# EAGLE schematic LiPo_Battery_Charger_MCP73831 (EAGLE 7.7.0)
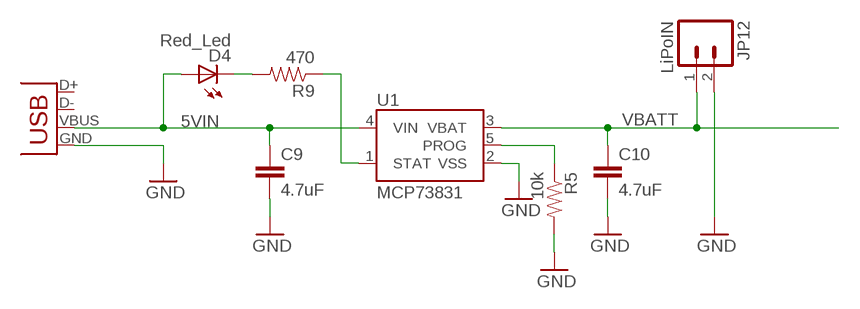
[diagram p0: schematic, sheet 1]

## Parts
C9  4.7uF  CAP0402-CAP  [0402-CAP]
C10  4.7uF  CAP0402-CAP  [0402-CAP]
D4  Red_Led  LED0603  [LED-0603]
JP12  LiPoIN  M02PTH  [1X02]
R5  10k  RESISTOR0402-RES  [0402-RES]
R9  470  RESISTOR0402-RES  [0402-RES]
U1  MCP73831  [SOT23-5]
X1  USB-MICROB  [USB-MICROB]

## Nets
5VIN: C9.1 D4.A U1.4(VIN) X1.VBUS
GND: C9.2 C10.2 JP12.2 R5.2 U1.2(VSS) X1.GND
N$8: D4.C R9.2
N$11: R5.1 U1.5(PROG)
N$14: R9.1 U1.1(STAT)
VBATT: C10.1 JP12.1 U1.3(VBAT)
Unconnected: X1.D+ X1.D-

## Library data of the parts
C9 C10 = SparkFun:CAP: Capacitor Standard 0603 ceramic capacitor, and 0.1" leaded capacitor.
D4 = SparkFun:LED: LEDs Standard schematic elements and footprints for 5mm, 3mm, 1206, and 0603 sized LEDs. 5mm - Spark Fun Electronics SKU : COM-00529 (and others)
JP12 = SparkFun:M02: Header 2 Standard 2-pin 0.1" header. Use with straight break away headers (SKU : PRT-00116), right angle break away headers (PRT-00553), swiss pins (PRT-00743), machine pins (PRT-00117), and female headers (PRT-00115). Molex polarized connector foot print use with SKU : PRT-08233 with associated crimp pins and housings.
R5 R9 = SparkFun:RESISTOR: Resistor Basic schematic elements and footprints for 0603, 1206, and PTH resistors.
U1 = SparkFun:MCP73831: Microchip's MCP73831 Miniature single cell, fully integrated Li-Ion, Li-polymer charge management controller http://ww1.microchip.com/downloads/en/DeviceDoc/21984a.pdf
X1 = SparkFun:USB: USB Connectors USB-B-PTH is fully proven SKU : PRT-00139 USB-miniB is fully proven SKU : PRT-00587 USB-A-PCB is untested. USB-A-H is throughly reviewed, but untested. Spark Fun Electronics SKU : PRT-00437 USB-B-SMT is throughly reviewed, but untested. Needs silkscreen touching up. USB-A-S has not been used/tested USB-MB-H has not been used/tested